# Altium schematic sheet DC Link.SchDoc
size A; SheetNumber: 6; SheetTotal: 6
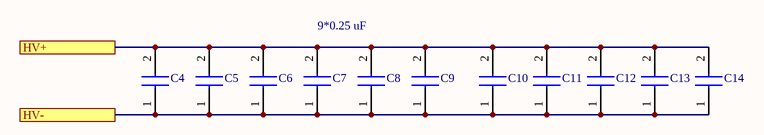
[diagram p0: DC Link.SchDoc]

## Parts
C4  B58031U9254M062  [B58031U9254M062]  (value not drawn)
C5  B58031U9254M062  [B58031U9254M062]  (value not drawn)
C6  B58031U9254M062  [B58031U9254M062]  (value not drawn)
C7  B58031U9254M062  [B58031U9254M062]  (value not drawn)
C8  B58031U9254M062  [B58031U9254M062]  (value not drawn)
C9  B58031U9254M062  [B58031U9254M062]  (value not drawn)
C10  B58031U9254M062  [B58031U9254M062]  (value not drawn)
C11  B58031U9254M062  [B58031U9254M062]  (value not drawn)
C12  B58031U9254M062  [B58031U9254M062]  (value not drawn)
C13  B58031U9254M062  [B58031U9254M062]  (value not drawn)
C14  B58031U9254M062  [B58031U9254M062]  (value not drawn)

## Ports
HV+, HV-

## Nets
HV+: C4.2 C5.2 C6.2 C7.2 C8.2 C9.2 C10.2 C11.2 C12.2 C13.2 C14.2 ; port HV+
HV-: C4.1 C5.1 C6.1 C7.1 C8.1 C9.1 C10.1 C11.1 C12.1 C13.1 C14.1 ; port HV-

## Notes on the sheet
- 9*0.25 uF

## Library data of the parts
C4-C14 = B58031U9254M062: Capacitor; Manufacturer_Name: TDK; Datasheet Link: https://product.tdk.com/system/files/dam/doc/product/capacitor/ceramic/ceralink/data_sheet/20/10/ds/b58031_lp.pdf; Height: 4.5mm; Manufacturer_Part_Number: B58031U9254M062; Mouser Part Number: 871-B58031U9254M062; Mouser Price/Stock: https://www.mouser.co.uk/ProductDetail/EPCOS-TDK/B58031U9254M062?qs=Mv7BduZupUir5egwM6Ifng%3D%3D; Arrow Part Number: B58031U9254M062; Arrow Price/Stock: https://www.arrow.com/en/products/b58031u9254m062/tdk?region=europe